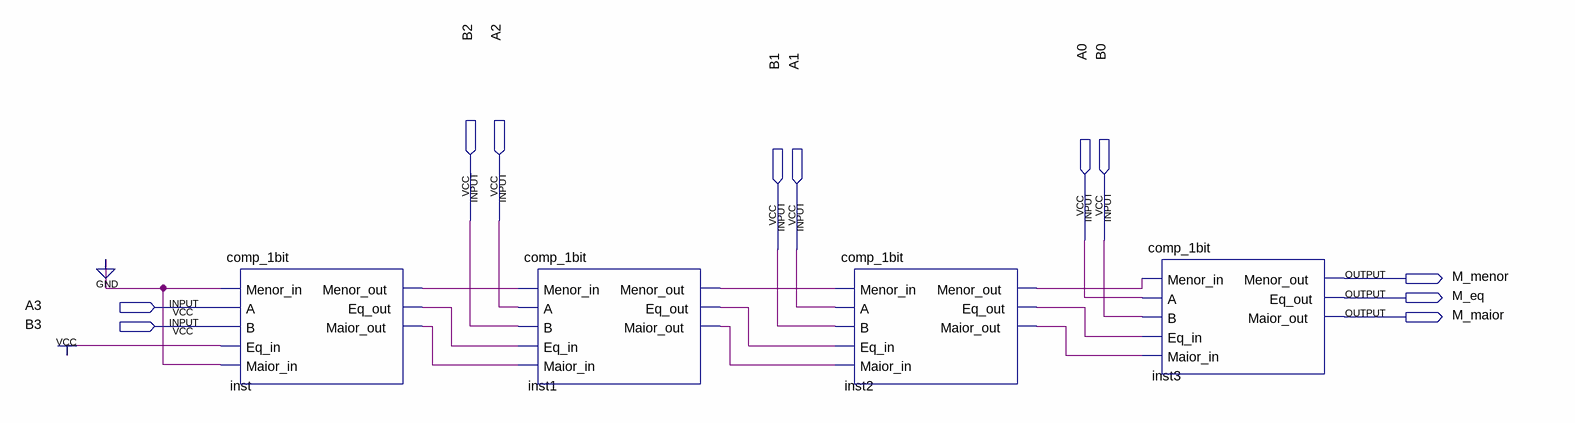
[diagram p0: schematic sheet]
// Quartus schematic comp_magnitude_4bits.bdf as structural Verilog: 4 symbols, 11 pins
module comp_magnitude_4bits (
  input  B2,
  input  A2,
  input  A0,
  input  B0,
  input  B1,
  input  A1,
  input  A3,
  input  B3,
  output M_menor,
  output M_eq,
  output M_maior
);

  wire inst1_eq_out, inst1_maior_out, inst1_menor_out, inst2_eq_out, inst2_maior_out, inst2_menor_out,
       inst_eq_out, inst_maior_out, inst_menor_out;

  comp_1bit inst (
    .Menor_in(1'b0), .A(A3), .B(B3), .Eq_in(1'b1), .Maior_in(1'b0), .Menor_out(inst_menor_out),
    .Eq_out(inst_eq_out), .Maior_out(inst_maior_out));
  comp_1bit inst1 (
    .Menor_in(inst_menor_out), .A(A2), .B(B2), .Eq_in(inst_eq_out), .Maior_in(inst_maior_out),
    .Menor_out(inst1_menor_out), .Eq_out(inst1_eq_out), .Maior_out(inst1_maior_out));
  comp_1bit inst2 (
    .Menor_in(inst1_menor_out), .A(A1), .B(B1), .Eq_in(inst1_eq_out), .Maior_in(inst1_maior_out),
    .Menor_out(inst2_menor_out), .Eq_out(inst2_eq_out), .Maior_out(inst2_maior_out));
  comp_1bit inst3 (
    .Menor_in(inst2_menor_out), .A(A0), .B(B0), .Eq_in(inst2_eq_out), .Maior_in(inst2_maior_out),
    .Menor_out(M_menor), .Eq_out(M_eq), .Maior_out(M_maior));
endmodule
